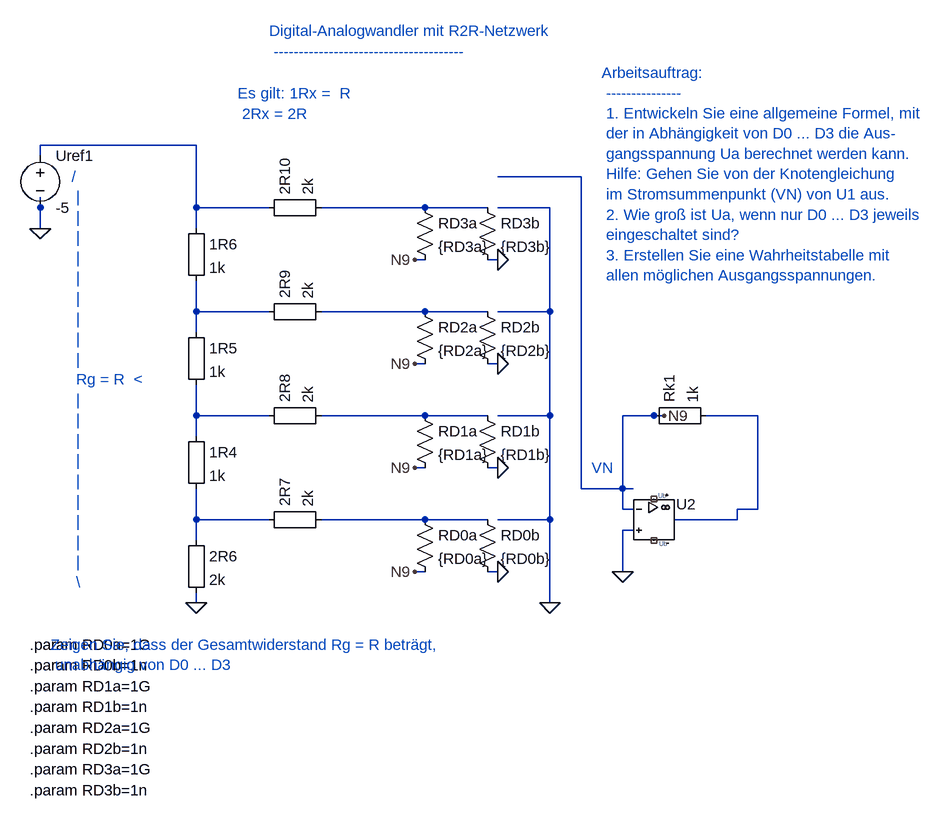
[diagram p0: schematic 8_1_3_DAC_mit_R2R_Netzwerk (1).asc]
8_1_3_DAC_mit_R2R_Netzwerk (1).asc, the LTspice schematic file:
Version 4
SHEET 1 880 680
WIRE 80 320 80 304
WIRE 992 784 976 784
WIRE 976 784 976 752
WIRE 976 752 992 752
WIRE 1056 800 1152 800
WIRE 1152 800 1152 784
WIRE 672 800 768 800
WIRE 672 640 768 640
WIRE 672 480 768 480
WIRE 672 320 768 320
WIRE 80 352 80 304
WIRE 976 880 976 816
WIRE 976 816 992 816
WIRE 1104 640 1184 640
WIRE 1184 640 1184 784
WIRE 1184 784 1152 784
WIRE 80 240 80 224
WIRE 80 224 320 224
WIRE 320 224 320 320
WIRE 320 432 320 480
WIRE 320 592 320 640
WIRE 320 912 320 928
WIRE 320 752 320 800
WIRE 320 320 320 352
WIRE 432 320 320 320
WIRE 320 480 320 512
WIRE 432 480 320 480
WIRE 512 320 672 320
WIRE 512 480 672 480
WIRE 512 640 672 640
WIRE 512 800 672 800
WIRE 320 640 320 672
WIRE 432 640 320 640
WIRE 320 800 320 832
WIRE 432 800 320 800
WIRE 784 800 864 800
WIRE 864 800 864 928
WIRE 784 640 864 640
WIRE 864 640 864 800
WIRE 784 480 864 480
WIRE 864 480 864 640
WIRE 784 320 864 320
WIRE 864 320 864 480
WIRE 976 752 976 640
WIRE 976 640 1024 640
WIRE 912 752 976 752
WIRE 912 592 912 752
WIRE 912 432 912 592
WIRE 784 272 912 272
WIRE 912 272 912 432
WIRE 768 560 784 560
WIRE 768 720 784 720
WIRE 768 880 784 880
WIRE 768 400 784 400
WIRE 672 560 656 560
WIRE 672 720 656 720
WIRE 672 880 656 880
WIRE 1024 640 1040 640
WIRE 672 400 656 400
FLAG 80 352 0
FLAG 976 880 0
FLAG 320 928 0
FLAG 864 928 0
FLAG 784 560 0
FLAG 784 720 0
FLAG 864 928 0
FLAG 784 880 0
FLAG 80 352 0
FLAG 976 880 0
FLAG 320 928 0
FLAG 784 400 0
FLAG 656 560 N9
FLAG 656 720 N9
FLAG 656 880 N9
FLAG 1040 640 N9
FLAG 656 400 N9
SYMBOL voltage 80 224 R0
SYMATTR InstName Uref1
SYMATTR Value -5
SYMBOL Misc\EuropeanResistor 304 816 R0
SYMATTR InstName 2R6
SYMATTR Value 2k
SYMBOL Misc\EuropeanResistor 416 816 R270
SYMATTR InstName 2R7
SYMATTR Value 2k
SYMBOL Misc\EuropeanResistor 416 656 R270
SYMATTR InstName 2R8
SYMATTR Value 2k
SYMBOL Misc\EuropeanResistor 416 496 R270
SYMATTR InstName 2R9
SYMATTR Value 2k
SYMBOL UniversalOpAmp2 1024 800 R0
SYMATTR InstName U2
SYMATTR Value UniversalOpAmp2
SYMBOL Misc\EuropeanResistor 1008 656 R270
SYMATTR InstName Rk1
SYMATTR Value 1k
SYMBOL Misc\EuropeanResistor 304 656 R0
SYMATTR InstName 1R4
SYMATTR Value 1k
SYMBOL Misc\EuropeanResistor 304 496 R0
SYMATTR InstName 1R5
SYMATTR Value 1k
SYMBOL Misc\EuropeanResistor 304 336 R0
SYMATTR InstName 1R6
SYMATTR Value 1k
SYMBOL Misc\EuropeanResistor 416 336 R270
SYMATTR InstName 2R10
SYMATTR Value 2k
SYMBOL res 656 784 R0
SYMATTR InstName RD0a
SYMATTR Value {RD0a}
SYMBOL res 752 784 R0
SYMATTR InstName RD0b
SYMATTR Value {RD0b}
SYMBOL res 656 624 R0
SYMATTR InstName RD1a
SYMATTR Value {RD1a}
SYMBOL res 752 624 R0
SYMATTR InstName RD1b
SYMATTR Value {RD1b}
SYMBOL res 656 464 R0
SYMATTR InstName RD2a
SYMATTR Value {RD2a}
SYMBOL res 752 464 R0
SYMATTR InstName RD2b
SYMATTR Value {RD2b}
SYMBOL res 656 304 R0
SYMATTR InstName RD3a
SYMATTR Value {RD3a}
SYMBOL res 752 304 R0
SYMATTR InstName RD3b
SYMATTR Value {RD3b}
TEXT 64 992 Left 2 !.param RD0a=1G
TEXT 64 1024 Left 2 !.param RD0b=1n
TEXT 64 1056 Left 2 !.param RD1a=1G
TEXT 64 1088 Left 2 !.param RD1b=1n
TEXT 64 1120 Left 2 !.param RD2a=1G
TEXT 64 1152 Left 2 !.param RD2b=1n
TEXT 64 1184 Left 2 !.param RD3a=1G
TEXT 64 1216 Left 2 !.param RD3b=1n
TEXT 432 48 Left 2 ;Digital-Analogwandler mit R2R-Netzwerk \n --------------------------------------
TEXT 944 112 Left 2 ;Arbeitsauftrag: \n --------------- \n 1. Entwickeln Sie eine allgemeine Formel, mit \n der in Abhängigkeit von D0 ... D3 die Aus- \n gangsspannung Ua berechnet werden kann. \n Hilfe: Gehen Sie von der Knotengleichung \n im Stromsummenpunkt (VN) von U1 aus. \n 2. Wie groß ist Ua, wenn nur D0 ... D3 jeweils \n eingeschaltet sind? \n 3. Erstellen Sie eine Wahrheitstabelle mit \n allen möglichen Ausgangsspannungen.
TEXT 384 144 Left 2 ;Es gilt: 1Rx =  R \n 2Rx = 2R
TEXT 96 992 Left 2 ;Zeigen Sie, dass der Gesamtwiderstand Rg = R beträgt, \n unabhängig von D0 ... D3
TEXT 128 272 Left 2 ;/ \n | \n | \n | \n | \n | \n | \n | \n | \n | \n Rg = R  < \n | \n | \n | \n | \n | \n | \n | \n | \n | \n \
TEXT 928 720 Left 2 ;VN

The netlist it stands for:
* 8_1_3_DAC_mit_R2R_Netzwerk (1).asc
V§Uref1 N006 0 -5
R§2R6 N009 0 2k
R§2R7 N009 N002 2k
R§2R8 N008 N003 2k
R§2R9 N007 N004 2k
XU2 0 N9 NC_01 NC_02 N001 level2 UniversalOpAmp2 Avol=1Meg GBW=10Meg Slew=10Meg Ilimit=25m Rail=0 Vos=0 En=0 Enk=0 In=0 Ink=0 Rin=500Meg  ; pins In+ In- V+ V- OUT
Rk1 N9 N001 1k
R§1R4 N008 N009 1k
R§1R5 N007 N008 1k
R§1R6 N006 N007 1k
R§2R10 N006 N005 2k
RD0a N002 N9 {RD0a}
RD0b N002 0 {RD0b}
RD1a N003 N9 {RD1a}
RD1b N003 0 {RD1b}
RD2a N004 N9 {RD2a}
RD2b N004 0 {RD2b}
RD3a N005 N9 {RD3a}
RD3b N005 0 {RD3b}
.param RD0a=1G
.param RD0b=1n
.param RD1a=1G
.param RD1b=1n
.param RD2a=1G
.param RD2b=1n
.param RD3a=1G
.param RD3b=1n
* Digital-Analogwandler mit R2R-Netzwerk
*  --------------------------------------
* Arbeitsauftrag:
*  ---------------
*  1. Entwickeln Sie eine allgemeine Formel, mit
*  der in Abhängigkeit von D0 ... D3 die Aus-
*  gangsspannung Ua berechnet werden kann.
*  Hilfe: Gehen Sie von der Knotengleichung
*  im Stromsummenpunkt (VN) von U1 aus.
*  2. Wie groß ist Ua, wenn nur D0 ... D3 jeweils
*  eingeschaltet sind?
*  3. Erstellen Sie eine Wahrheitstabelle mit
*  allen möglichen Ausgangsspannungen.
* Es gilt: 1Rx =  R
*  2Rx = 2R
* Zeigen Sie, dass der Gesamtwiderstand Rg = R beträgt,
*  unabhängig von D0 ... D3
* /
*  |
*  |
*  |
*  |
*  |
*  |
*  |
*  |
*  |
*  Rg = R  <
*  |
*  |
*  |
*  |
*  |
*  |
*  |
*  |
*  |
*  \
* VN
.lib UniversalOpAmp2.lib
.backanno
.end